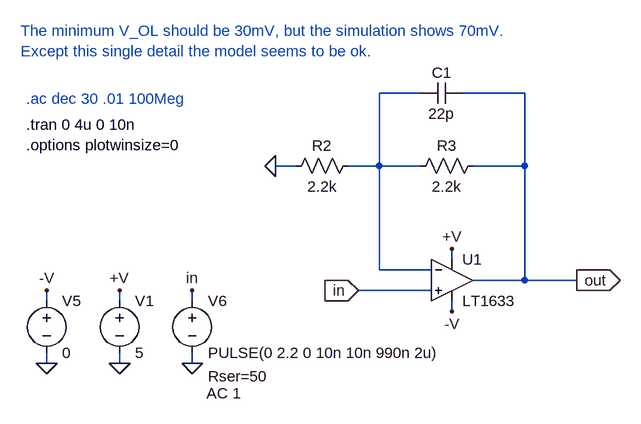
[diagram p0: schematic LT1633_test.asc]
LT1633_test.asc, the LTspice schematic file:
Version 4
SHEET 1 2412 1728
WIRE 48 -96 -16 -96
WIRE 208 -96 112 -96
WIRE -144 16 -176 16
WIRE -16 16 -16 -96
WIRE -16 16 -64 16
WIRE 48 16 -16 16
WIRE 208 16 208 -96
WIRE 208 16 128 16
WIRE 96 160 96 144
WIRE -16 176 -16 16
WIRE 64 176 -16 176
WIRE 208 192 208 16
WIRE 208 192 128 192
WIRE 288 192 208 192
WIRE 64 208 -48 208
WIRE -528 224 -528 208
WIRE -416 224 -416 208
WIRE -304 224 -304 208
WIRE 96 240 96 224
WIRE -528 320 -528 304
WIRE -416 320 -416 304
WIRE -304 320 -304 304
FLAG -416 320 0
FLAG -176 16 0
FLAG 96 144 +V
FLAG -416 208 +V
FLAG -528 320 0
FLAG -528 208 -V
FLAG 96 240 -V
FLAG -48 208 in
IOPIN -48 208 In
FLAG -304 320 0
FLAG -304 208 in
FLAG 288 192 out
IOPIN 288 192 Out
SYMBOL voltage -416 208 R0
WINDOW 123 0 0 Left 0
WINDOW 39 0 0 Left 0
SYMATTR InstName V1
SYMATTR Value 5
SYMBOL res -48 0 R90
WINDOW 0 0 56 VBottom 0
WINDOW 3 32 56 VTop 0
SYMATTR InstName R2
SYMATTR Value 2.2k
SYMBOL res 144 0 R90
WINDOW 0 0 56 VBottom 0
WINDOW 3 32 56 VTop 0
SYMATTR InstName R3
SYMATTR Value 2.2k
SYMBOL cap 112 -112 R90
WINDOW 0 0 32 VBottom 0
WINDOW 3 32 32 VTop 0
SYMATTR InstName C1
SYMATTR Value 22p
SYMBOL voltage -528 208 R0
WINDOW 123 0 0 Left 0
WINDOW 39 0 0 Left 0
SYMATTR InstName V5
SYMATTR Value 0
SYMBOL voltage -304 208 R0
WINDOW 123 22 158 Left 0
WINDOW 39 24 132 Left 0
SYMATTR Value2 AC 1
SYMATTR SpiceLine Rser=50
SYMATTR InstName V6
SYMATTR Value PULSE(0 2.2 0 10n 10n 990n 2u)
SYMBOL Opamps\\LT1633 96 128 R0
SYMATTR InstName U1
TEXT -560 -88 Left 0 ;.ac dec 30 .01 100Meg
TEXT -560 -48 Left 0 !.tran 0 4u 0 10n
TEXT -560 -16 Left 0 !.options plotwinsize=0
TEXT -568 -192 Left 0 ;The minimum V_OL should be 30mV, but the simulation shows 70mV.\nExcept this single detail the model seems to be ok.

The netlist it stands for:
* LT1633_test.asc
V1 +V 0 5
R2 N001 0 2.2k
R3 out N001 2.2k
C1 out N001 22p
V5 -V 0 0
V6 in 0 PULSE(0 2.2 0 10n 10n 990n 2u) AC 1 Rser=50
XU1 in N001 +V -V out LT1633  ; pins In+ In- V+ V- OUT
* .ac dec 30 .01 100Meg
.tran 0 4u 0 10n
.options plotwinsize=0
* The minimum V_OL should be 30mV, but the simulation shows 70mV.
* Except this single detail the model seems to be ok.
.backanno
.end